# Altium project ECard.PrjPcb
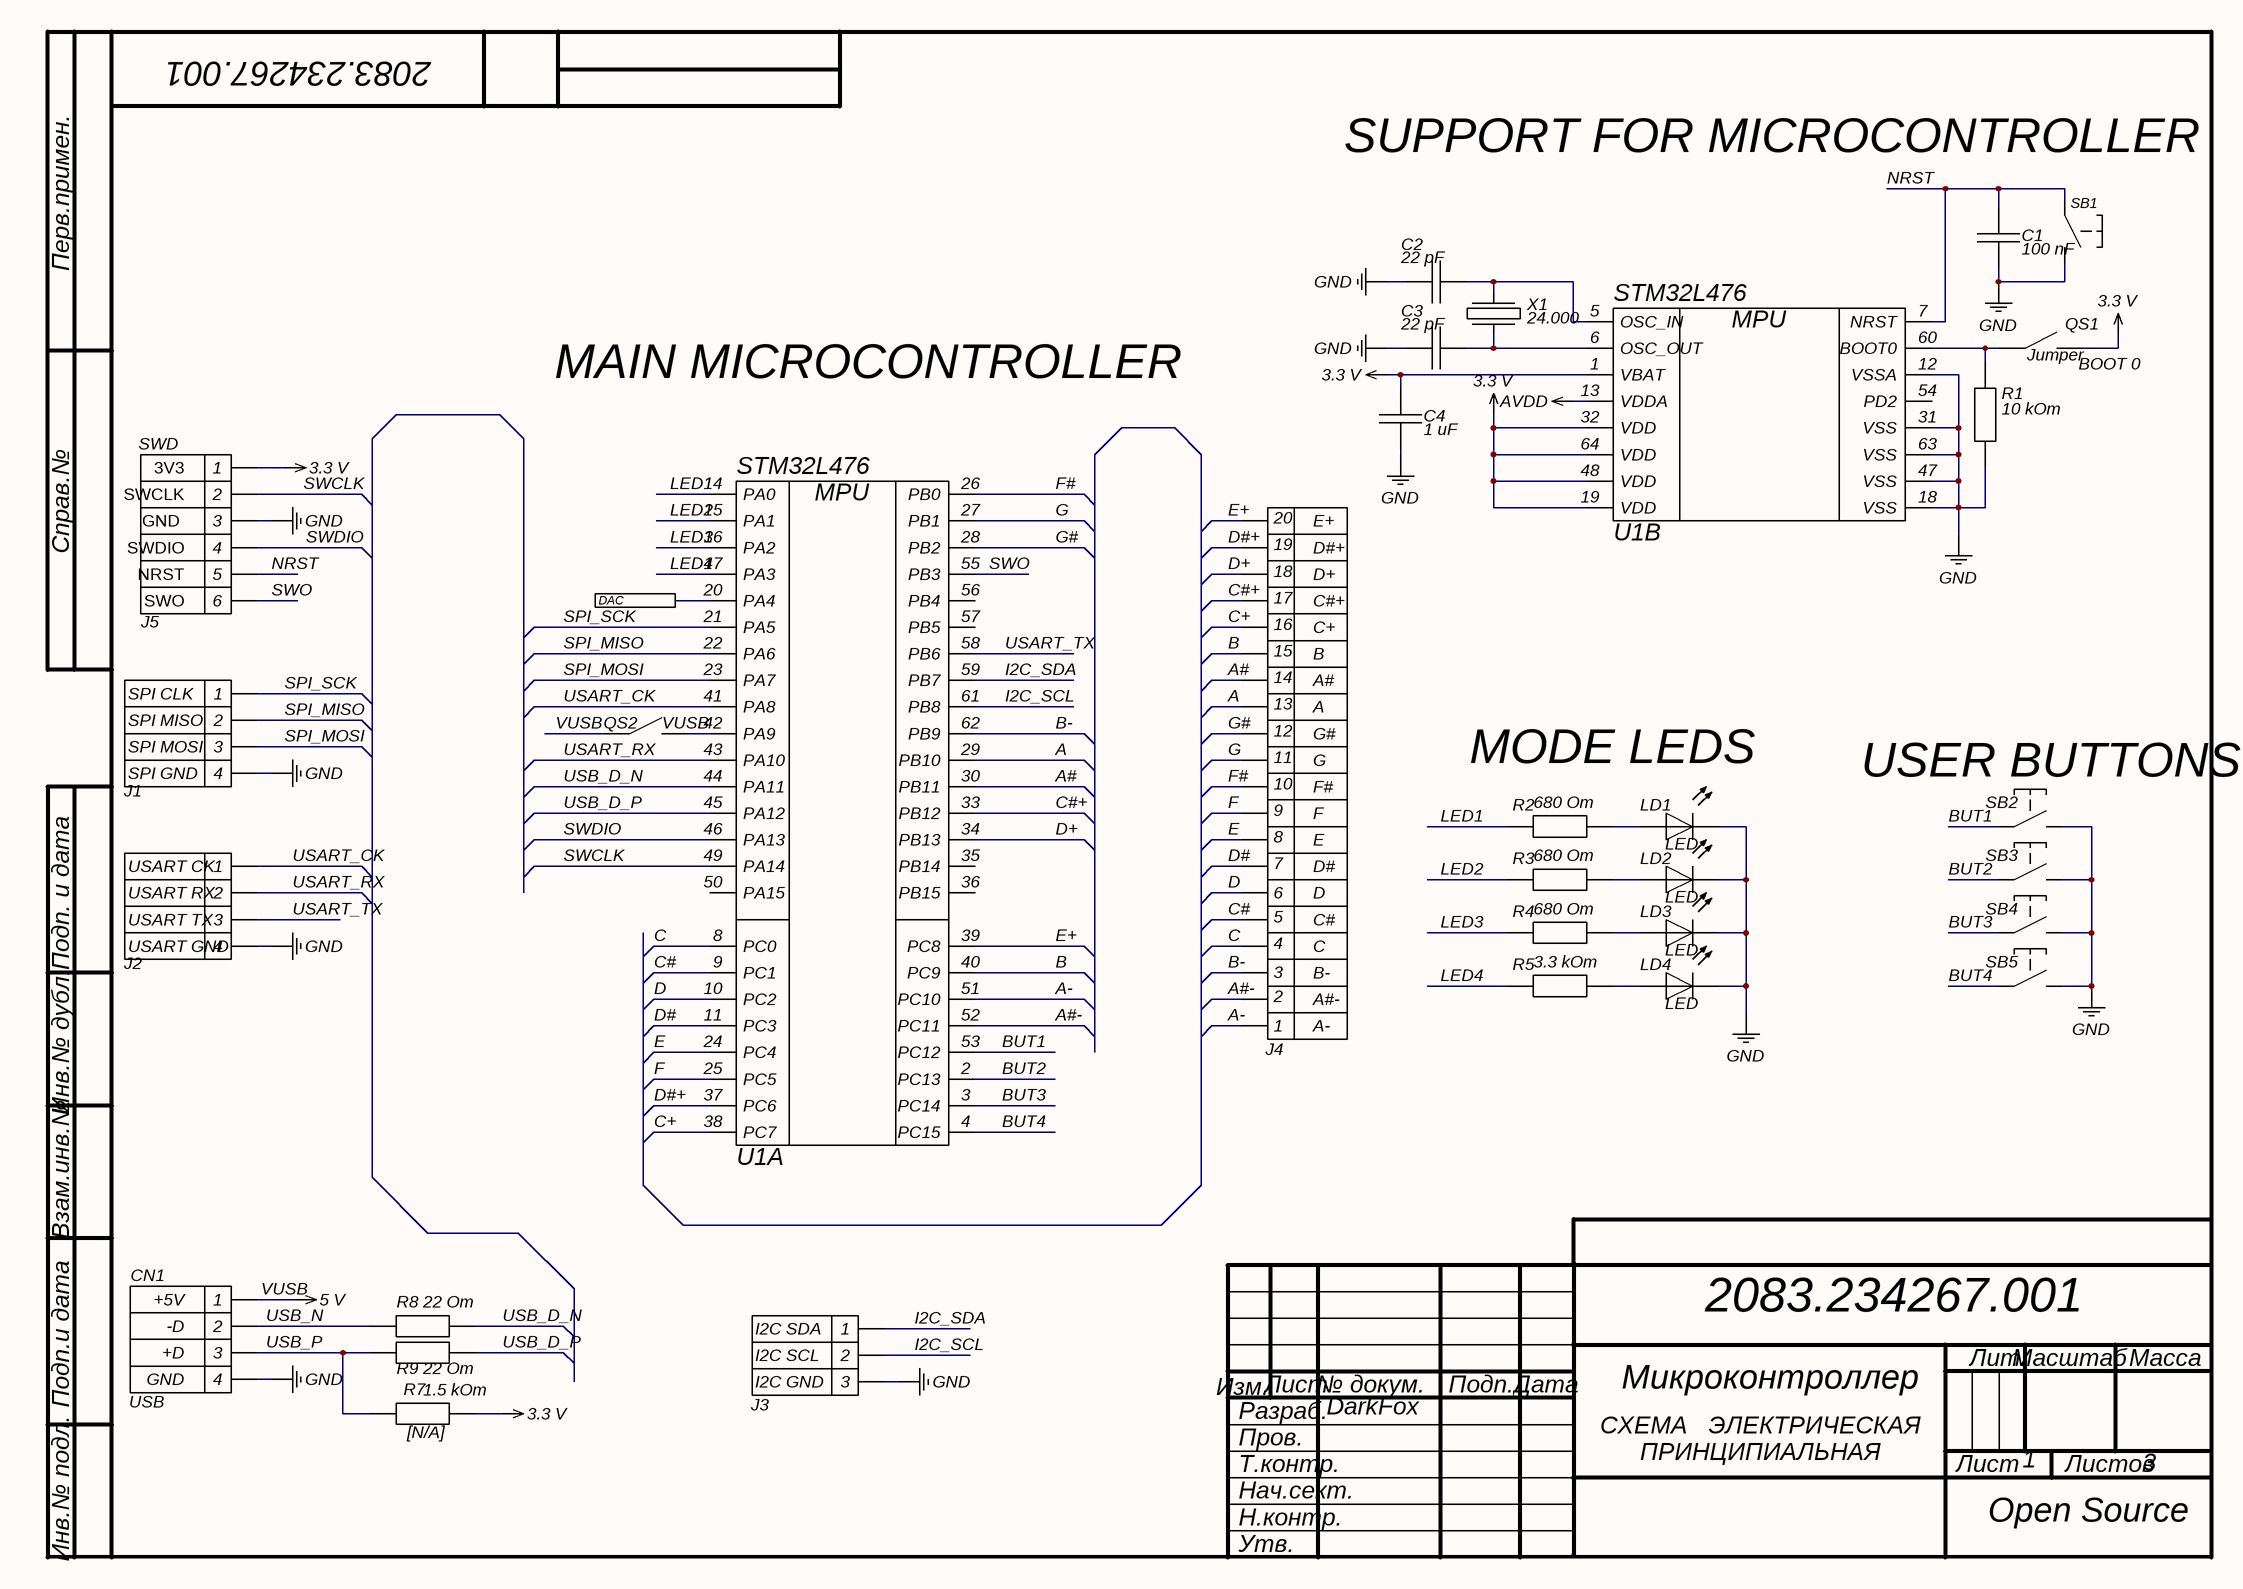
[diagram p0: CPU.SchDoc]
3 sheets, 58 parts. Net scope: flat (ports and power ports of the same name join across sheets).
Board file: ECARD.PcbDoc
Sheets:
  CPU.SchDoc
  Power.SchDoc
  Audio.SchDoc

## Sheet CPU.SchDoc: Микроконтроллер
size 420 x 297 mm; Author: DarkFox; CompanyName: Open Source; DocumentNumber: 1; SheetNumber: 1; SheetTotal: 3; PageSetup: Record=PageOptions|CenterHorizontal=True|CenterVertical=True|PrintScale=0.94|XCorrection=1.00|YCorrection=1.00|PrintKind=1|BorderSize=5000000|LeftOffset=0|BottomOffset=0|Orientation=1|PaperLength=1000|PaperWidth=1000|Scale=100|PaperSource=7|PrintQuality=-4|MediaType=1|DitherType=10|PaperKind=A4|PrintScaleMode=1; DecimalNumber: 2083.234267.001; Name: Микроконтроллер; DocumentName: Sheet1.SCHDOC

### Parts
C1  100 nF  [0603]
C2  22 pF  [0805]
C3  22 pF  [0805]
C4  1 uF  [0603]
CN1  USB  [USB]
J1  4x2.54  [SMD 4x2.54]  (value not drawn)
J2  4x2.54  [SMD 4x2.54]  (value not drawn)
J3  3x2.54  [SMD 3x2.54]  (value not drawn)
J4  piano_full  [PIANO_FULL]  (value not drawn)
J5  SWD  [SWD_6_2.54]
LD1  LED  [0805]
LD2  LED  [0805]
LD3  LED  [0805]
LD4  LED  [0805]
QS1  Jumper  [SB]
QS2  Jumper  [SB]  (value not drawn)
R1  10 kOm  [0603]
R2  680 Om  [1206]
R3  680 Om  [1206]
R4  680 Om  [1206]
R5  3.3 kOm  [1206]
R7  1.5 kOm  [1206]
R8  22 Om  [1206]
R9  22 Om  [1206]
SB1  but  [TS44-SMD]  (value not drawn)
SB2  but  [TS44-SMD]  (value not drawn)
SB3  but  [TS44-SMD]  (value not drawn)
SB4  but  [TS44-SMD]  (value not drawn)
SB5  but  [TS44-SMD]  (value not drawn)
U1  STM32L476  [LQFP - 64]  (parts A,B of 2)
X1  24.000  [CSX-3225]

### Ports
DAC

### Nets
3.3 V: C4.2 J5.1(3V3) QS1.2 R7.2 U1.1(VBAT) U1.19(VDD) U1.32(VDD) U1.48(VDD) U1.64(VDD)
AVDD: U1.13(VDDA)
GND: C1.1 C2.1 C3.1 C4.1 CN1.4(GND) J1.4 J2.4 J3.3 J5.3(GND) LD1.2 LD2.2 LD3.2 LD4.2 R1.1 SB1.2 SB2.2 SB3.2 SB4.2 SB5.2 U1.12(VSSA) U1.18(VSS) U1.31(VSS) U1.47(VSS) U1.63(VSS)
VUSB: CN1.1(+5V) QS2.1  [also labelled 5 V]
A: J4.13(A) U1.29(PB10)
A#: J4.14(A#) U1.30(PB11)
A#-: J4.2(A#-) U1.52(PC11)
A-: J4.1(A-) U1.51(PC10)
B: J4.15(B) U1.40(PC9)
B-: J4.3(B-) U1.62(PB9)
BUT1: SB2.1 U1.53(PC12)
BUT2: SB3.1 U1.2(PC13)
BUT3: SB4.1 U1.3(PC14)
BUT4: SB5.1 U1.4(PC15)
C: J4.4(C) U1.8(PC0)
C#: J4.5(C#) U1.9(PC1)
C#+: J4.17(C#+) U1.33(PB12)
C+: J4.16(C+) U1.38(PC7)
D: J4.6(D) U1.10(PC2)
D#: J4.7(D#) U1.11(PC3)
D#+: J4.19(D#+) U1.37(PC6)
D+: J4.18(D+) U1.34(PB13)
E: J4.8(E) U1.24(PC4)
E+: J4.20(E+) U1.39(PC8)
F: J4.9(F) U1.25(PC5)
F#: J4.10(F#) U1.26(PB0)
G: J4.11(G) U1.27(PB1)
G#: J4.12(G#) U1.28(PB2)
I2C_SCL: J3.2 U1.61(PB8)
I2C_SDA: J3.1 U1.59(PB7)
LED1: R2.1 U1.14(PA0)
LED2: R3.1 U1.15(PA1)
LED3: R4.1 U1.16(PA2)
LED4: R5.1 U1.17(PA3)
NRST: C1.2 J5.5(NRST) SB1.1 U1.7(NRST)
SPI_MISO: J1.2 U1.22(PA6)
SPI_MOSI: J1.3 U1.23(PA7)
SPI_SCK: J1.1 U1.21(PA5)
SWCLK: J5.2(SWCLK) U1.49(PA14)
SWDIO: J5.4(SWDIO) U1.46(PA13)
SWO: J5.6(SWO) U1.55(PB3)
USART_CK: J2.1 U1.41(PA8)
USART_RX: J2.2 U1.43(PA10)
USART_TX: J2.3 U1.58(PB6)
USB_D_N: R8.2 U1.44(PA11)
USB_D_P: R9.2 U1.45(PA12)
USB_N: CN1.2(-D) R8.1
USB_P: CN1.3(+D) R7.1 R9.1
NetC2_2: C2.2 U1.5(OSC_IN) X1.2
NetC3_2: C3.2 U1.6(OSC_OUT) X1.1
NetLD1_1: LD1.1 R2.2
NetLD2_1: LD2.1 R3.2
NetLD3_1: LD3.1 R4.2
NetLD4_1: LD4.1 R5.2
NetQS1_1: QS1.1 R1.2 U1.60(BOOT0)
NetQS2_2: QS2.2 U1.42(PA9)
NetR10_2: U1.20(PA4) ; port DAC

Not connected (* = marked no-connect by the designer): U1 35(PB14) 36(PB15) 50(PA15) 54(PD2) 56(PB4) 57(PB5)

### Notes on the sheet
- SUPPORT FOR MICROCONTROLLER
- MAIN MICROCONTROLLER
- (near QS1) BOOT 0
- (near J1) SPI CLK
- (near J1) SPI MISO
- (near QS2) VUSB
- (near J1) SPI MOSI
- (near J1) SPI GND
- MODE LEDS
- (near SB2) USER BUTTONS
- (near J2) USART CK
- (near J2) USART RX
- (near J2) USART TX
- (near J2) USART GND
- (near J3) I2C SDA
- (near J3) I2C SCL
- (near J3) I2C GND
- (near R7) [N/A]
- Перв.примен.
- Справ.№
- Подп. и дата
- Инв.№ дубл.
- Взам.инв.№
- Подп.и дата
- Разраб.
- Изм.
- Лист
- № докум.
- Подп.
- Дата
- Лит.
- Масштаб
- Масса
- Т.контр.
- Пров.
- СХЕМА   ЭЛЕКТРИЧЕСКАЯ
- ПРИНЦИПИАЛЬНАЯ
- Листов
- Инв.№ подл.
- Утв.
- Н.контр.
- Нач.сект.
- (in symbol STM32L476RG, part A) MPU
- (in symbol STM32L476RG, part B) MPU

### Library data of the parts
C1-C4 = Cup
CN1 = USB_2
R1-R5 R7-R9 = Res
SB1-SB5 = but: pin to pad: 2>3+4
U1 = STM32L476RG: The ultra-low-power microcontrollers based on the highperformance Arm Cortex-M4 32-bit RISC core operating at a frequency of up to 80 MHz.
X1 = CSX-3225: Crystal Resonator; pin to pad: 2>3

## Sheet Power.SchDoc: Система питания
size 420 x 297 mm; Author: DarkFox; CompanyName: Open Source; DocumentNumber: 2; SheetNumber: 2; SheetTotal: 3; PageSetup: Record=PageOptions|CenterHorizontal=True|CenterVertical=True|PrintScale=0.94|XCorrection=1.00|YCorrection=1.00|PrintKind=1|BorderSize=5000000|LeftOffset=0|BottomOffset=0|Orientation=1|PaperLength=1000|PaperWidth=1000|Scale=100|PaperSource=7|PrintQuality=-4|MediaType=1|DitherType=10|PaperKind=A4|PrintScaleMode=1; DecimalNumber: 2083.234267.003; Name: Система питания; DocumentName: Sheet1.SCHDOC
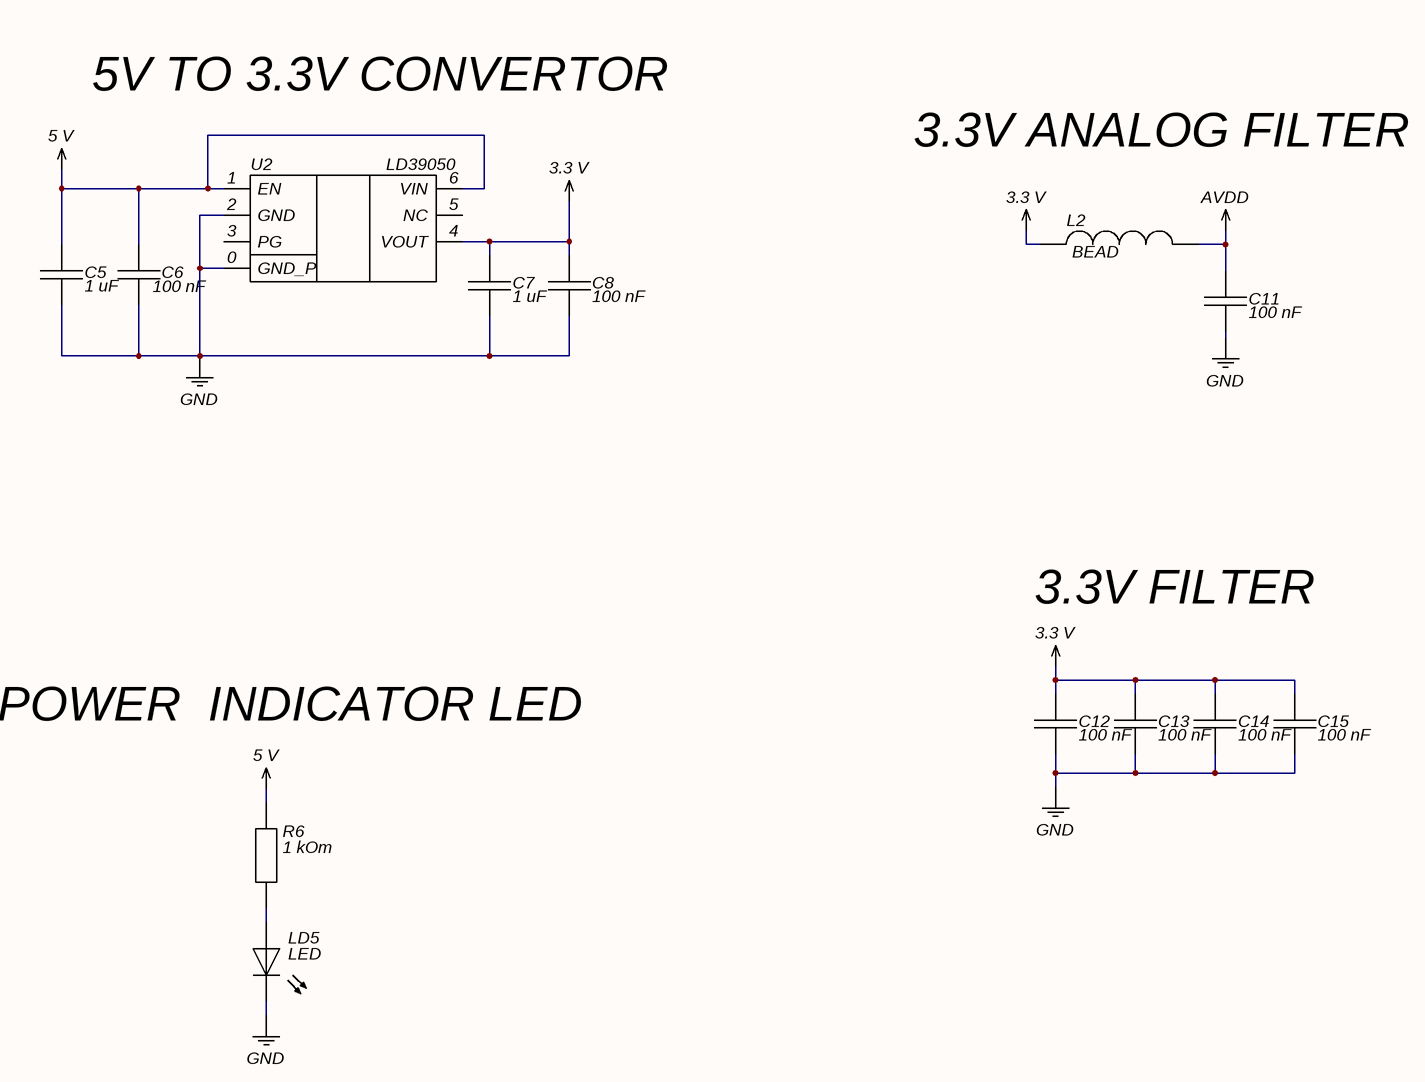
[diagram p1: Power.SchDoc]

### Parts
C5  1 uF  [0603]
C6  100 nF  [0603]
C7  1 uF  [0603]
C8  100 nF  [0603]
C11  100 nF  [0603]
C12  100 nF  [0603]
C13  100 nF  [0603]
C14  100 nF  [0603]
C15  100 nF  [0603]
L2  100 mH  [0603]  (value not drawn)
LD5  LED  [0603]
R6  1 kOm  [0603]
U2  LD39050  [DFN6]

### Nets
3.3 V: C7.1 C8.1 C12.2 C13.2 C14.2 C15.2 L2.1 U2.4(VOUT)
5 V: C5.1 C6.1 R6.2 U2.1(EN) U2.6(VIN)  [project net VUSB]
AVDD: C11.2 L2.2
GND: C5.2 C6.2 C7.2 C8.2 C11.1 C12.1 C13.1 C14.1 C15.1 LD5.2 U2.0(GND_P) U2.2(GND)
NetLD5_1: LD5.1 R6.1

Not connected (* = marked no-connect by the designer): U2 3(PG) 5(NC)

### Notes on the sheet
- 5V TO 3.3V CONVERTOR
- 3.3V ANALOG FILTER
- (near L2) BEAD
- 3.3V FILTER
- POWER  INDICATOR LED
- Перв.примен.
- Справ.№
- Подп. и дата
- Инв.№ дубл.
- Взам.инв.№
- Подп.и дата
- Разраб.
- Изм.
- Лист
- № докум.
- Подп.
- Дата
- Лит.
- Масштаб
- Масса
- Т.контр.
- Пров.
- СХЕМА   ЭЛЕКТРИЧЕСКАЯ
- ПРИНЦИПИАЛЬНАЯ
- Листов
- Инв.№ подл.
- Утв.
- Н.контр.
- Нач.сект.

### Library data of the parts
C5-C8 C11-C15 = Cup
L2 = Inductor
R6 = Res
U2 = LD39050: voltage regulator

## Sheet Audio.SchDoc: Аналоговая часть
size 420 x 297 mm; Author: DarkFox; CompanyName: Open Source; DocumentNumber: 3; SheetNumber: 3; SheetTotal: 3; PageSetup: Record=PageOptions|CenterHorizontal=True|CenterVertical=True|PrintScale=0.94|XCorrection=1.00|YCorrection=1.00|PrintKind=1|BorderSize=5000000|LeftOffset=0|BottomOffset=0|Orientation=1|PaperLength=1000|PaperWidth=1000|Scale=100|PaperSource=7|PrintQuality=-4|MediaType=1|DitherType=10|PaperKind=A4|PrintScaleMode=1; DecimalNumber: 2083.234267.004; Name: Аналоговая часть; DocumentName: Sheet1.SCHDOC
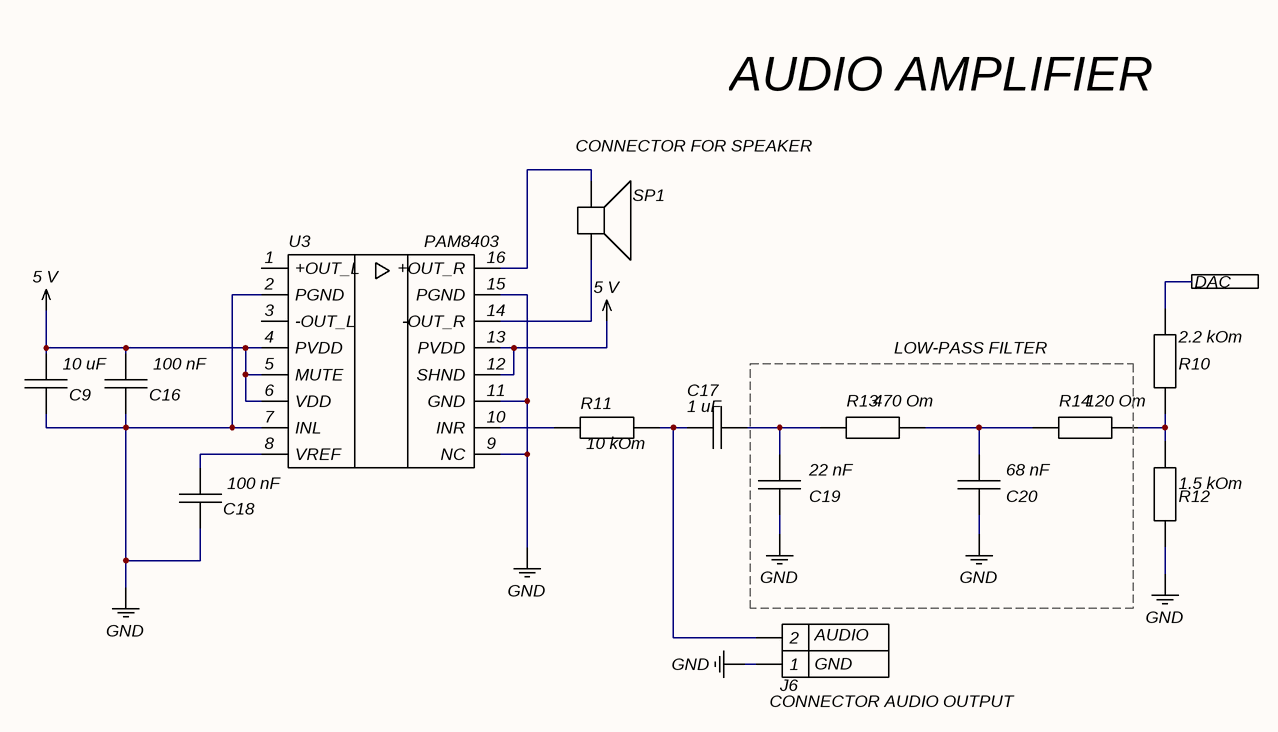
[diagram p2: Audio.SchDoc]

### Parts
C9  10 uF  [0805]
C16  100 nF  [0805]
C17  1 uF  [0805]
C18  100 nF  [0805]
C19  22 nF  [0805]
C20  68 nF  [0805]
J6  2x2.54  [SMD 2x2.54]  (value not drawn)
R10  2.2 kOm  [1206]
R11  10 kOm  [0805]
R12  1.5 kOm  [1206]
R13  470 Om  [1206]
R14  120 Om  [1206]
SP1  speaker  [SMD 2x2.54]  (value not drawn)
U3  PAM8403  [sop16]

### Blocks framed on the sheet
LOW-PASS FILTER: C19 C20 R13 R14

### Ports
DAC

### Nets
5 V: C9.2 C16.2 U3.4(PVDD) U3.5(MUTE) U3.6(VDD) U3.12(SHND) U3.13(PVDD)  [project net VUSB]
GND: C9.1 C16.1 C18.1 C19.1 C20.1 J6.1 R12.1 U3.2(PGND) U3.7(INL) U3.9(NC) U3.11(GND) U3.15(PGND)
NetC17_1: C17.1 J6.2 R11.2
NetC17_2: C17.2 C19.2 R13.1
NetC18_2: C18.2 U3.8(VREF)
NetC20_2: C20.2 R13.2 R14.1
NetR10_1: R10.1 R12.2 R14.2
NetR10_2: R10.2 ; port DAC
NetR11_1: R11.1 U3.10(INR)
NetSP1_1: SP1.1 U3.14(-OUT_R)
NetSP1_2: SP1.2 U3.16(+OUT_R)

Not connected (* = marked no-connect by the designer): U3 1(+OUT_L_) 3(-OUT_L)

### Notes on the sheet
- AUDIO AMPLIFIER
- (near SP1) CONNECTOR FOR SPEAKER
- (near J6) AUDIO
- (near J6) CONNECTOR AUDIO OUTPUT
- (near J6) GND
- Перв.примен.
- Справ.№
- Подп. и дата
- Инв.№ дубл.
- Взам.инв.№
- Подп.и дата
- Разраб.
- Изм.
- Лист
- № докум.
- Подп.
- Дата
- Лит.
- Масштаб
- Масса
- Т.контр.
- Пров.
- СХЕМА   ЭЛЕКТРИЧЕСКАЯ
- ПРИНЦИПИАЛЬНАЯ
- Листов
- Инв.№ подл.
- Утв.
- Н.контр.
- Нач.сект.

### Library data of the parts
C9 C16-C20 = Cup
R10-R14 = Res

## Nets that join several sheets
3.3 V: CPU (9 pins), Power (8 pins)
AVDD: CPU (U1.13), Power (C11.2 L2.2)
GND: CPU (24 pins), Power (12 pins), Audio (12 pins)
VUSB: CPU (CN1.1 QS2.1), Power (5 pins), Audio (7 pins)
NetR10_2: CPU (U1.20), Audio (R10.2)